# EasyEDA Pro project ProPrj_NavBot-EN01_2025-11-07.epro, schematic MAIN

## Sheets
1 P1: Board Name: MAIN; Create Date: 2025-05-14; Page Name: P1; Project Name: NavBot-EN01; Schematic Name: MAIN; Update Date: 2025-10-31; Add into BOM: yes; Convert to PCB: yes; Date: 2022-08-08; Draw By: MUSHIBO; REV: 1.0; Sheet: 1/1
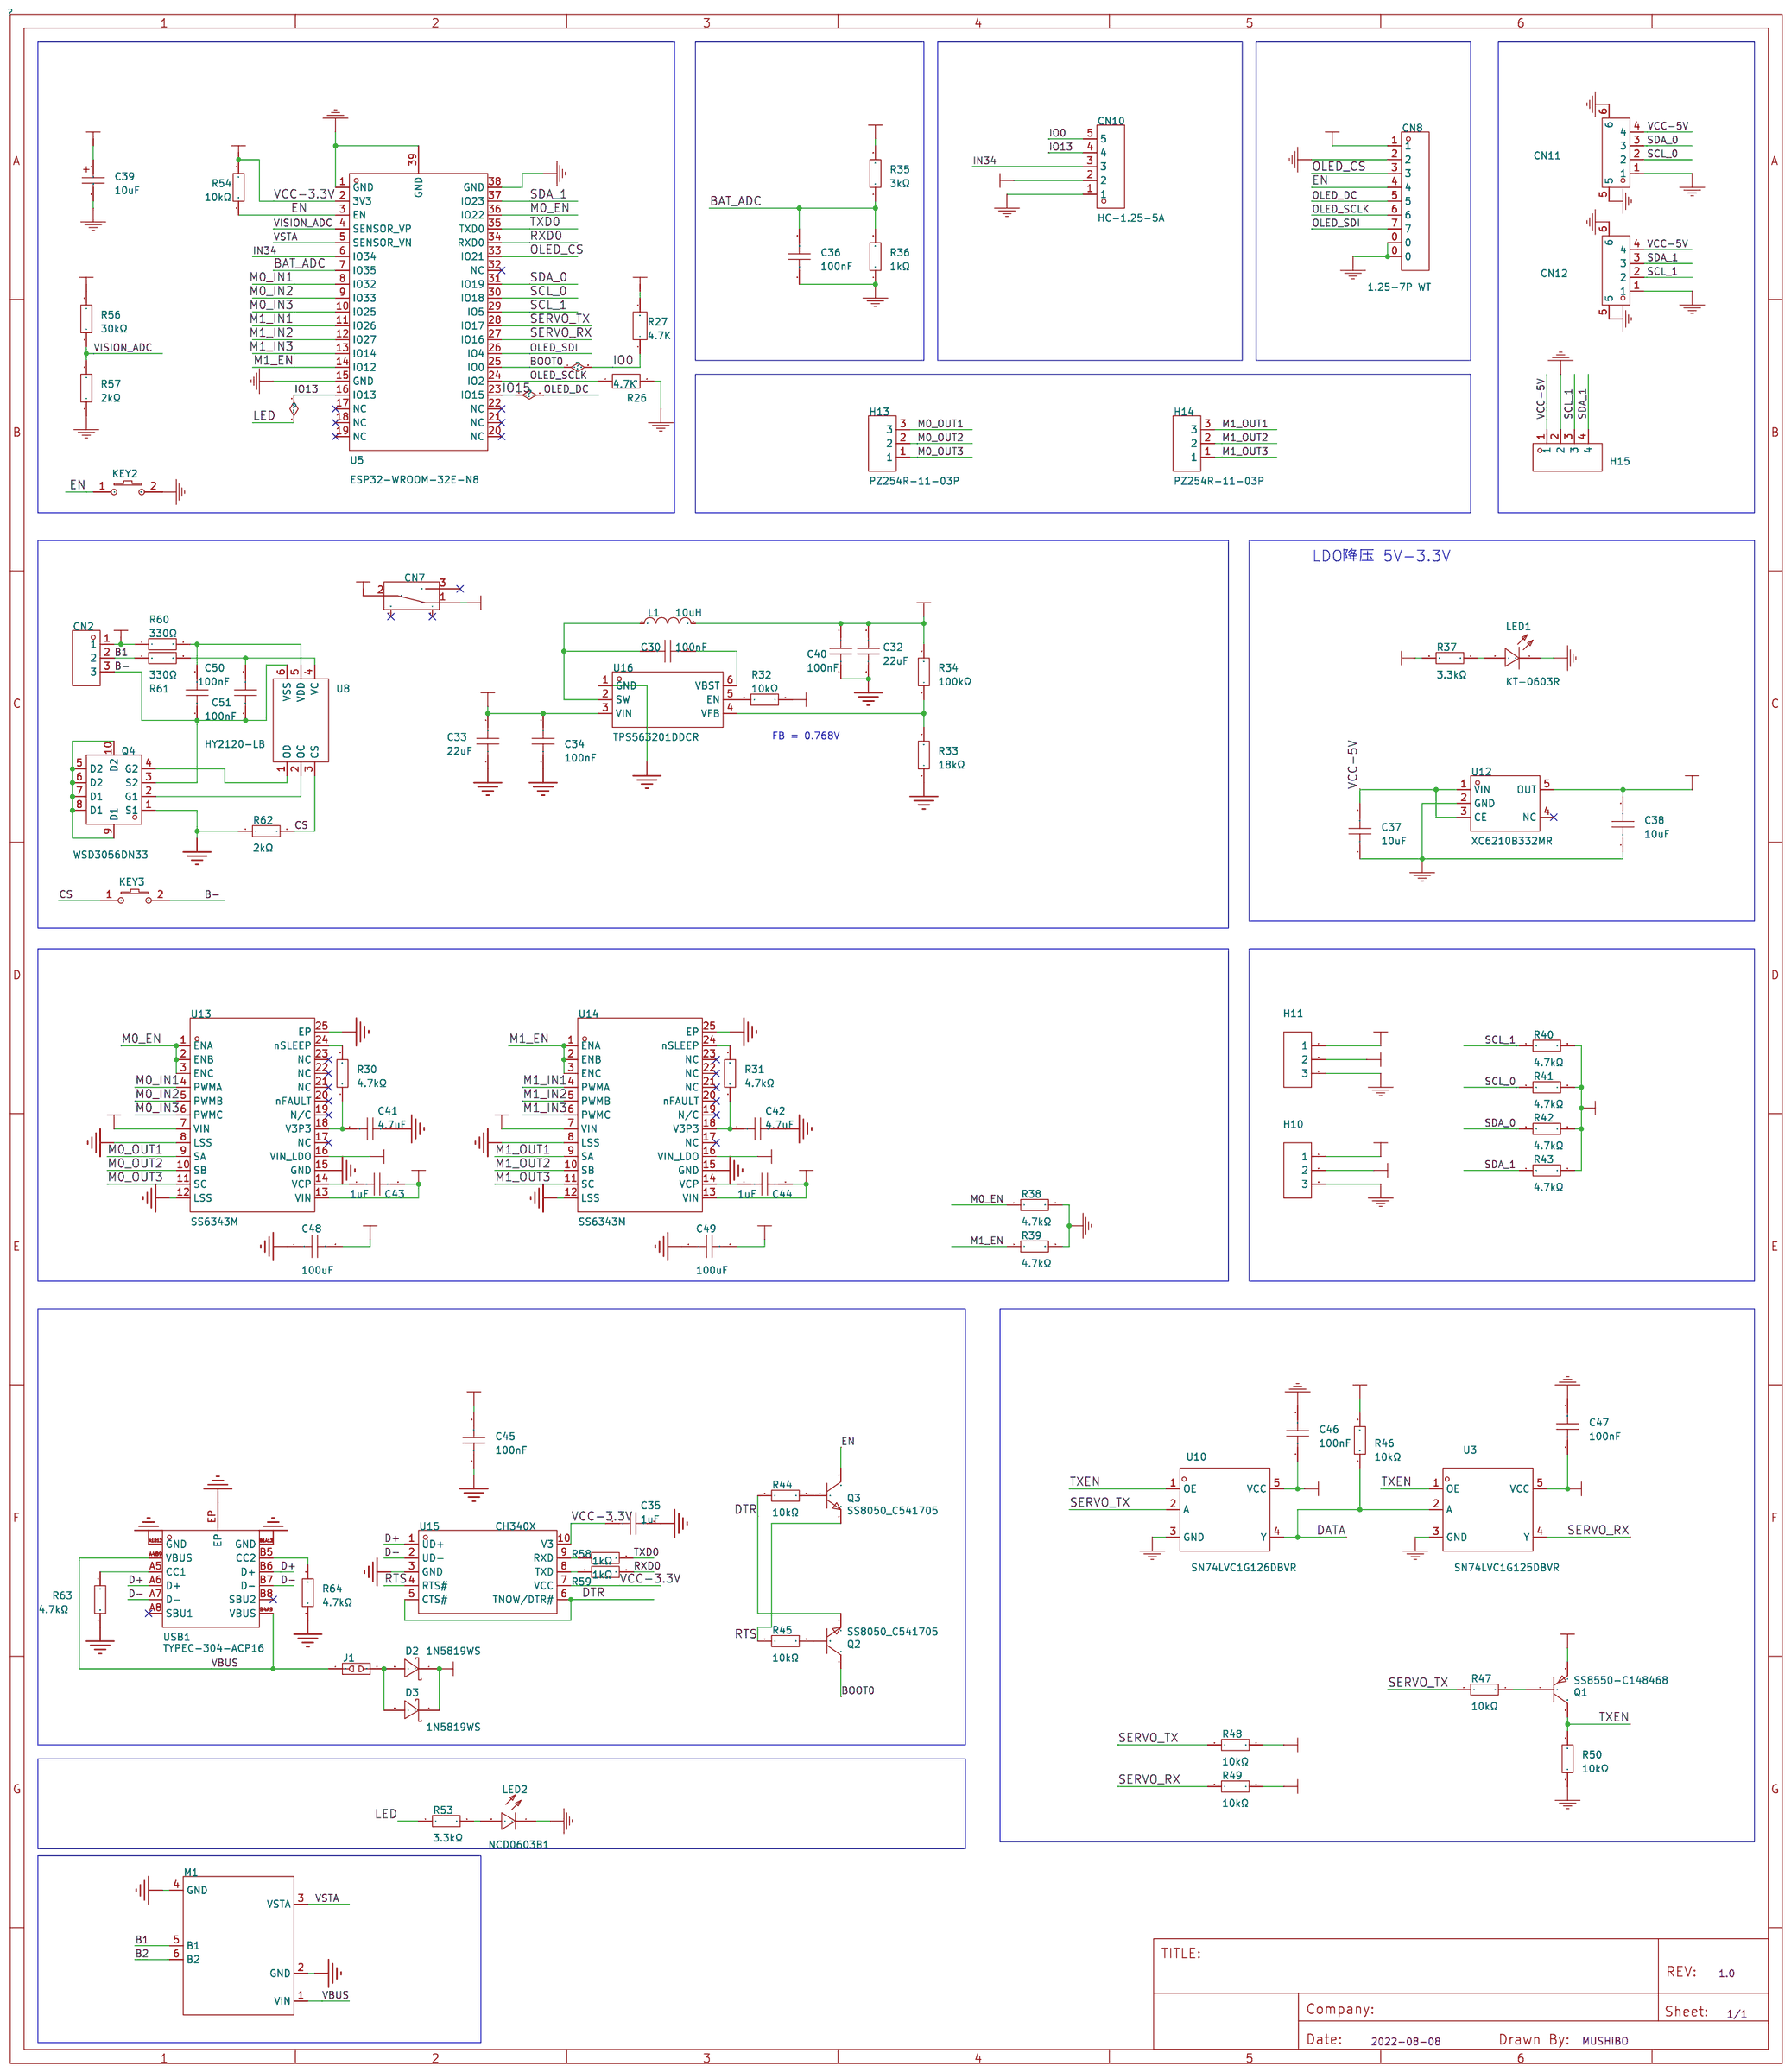
[diagram p6: P1]
2 version: Create Date: 2025-07-21; Page Name: version; Update Date: 2025-09-17; Company: 嘉立创EDA; Page Size: A4; Version: V1.0
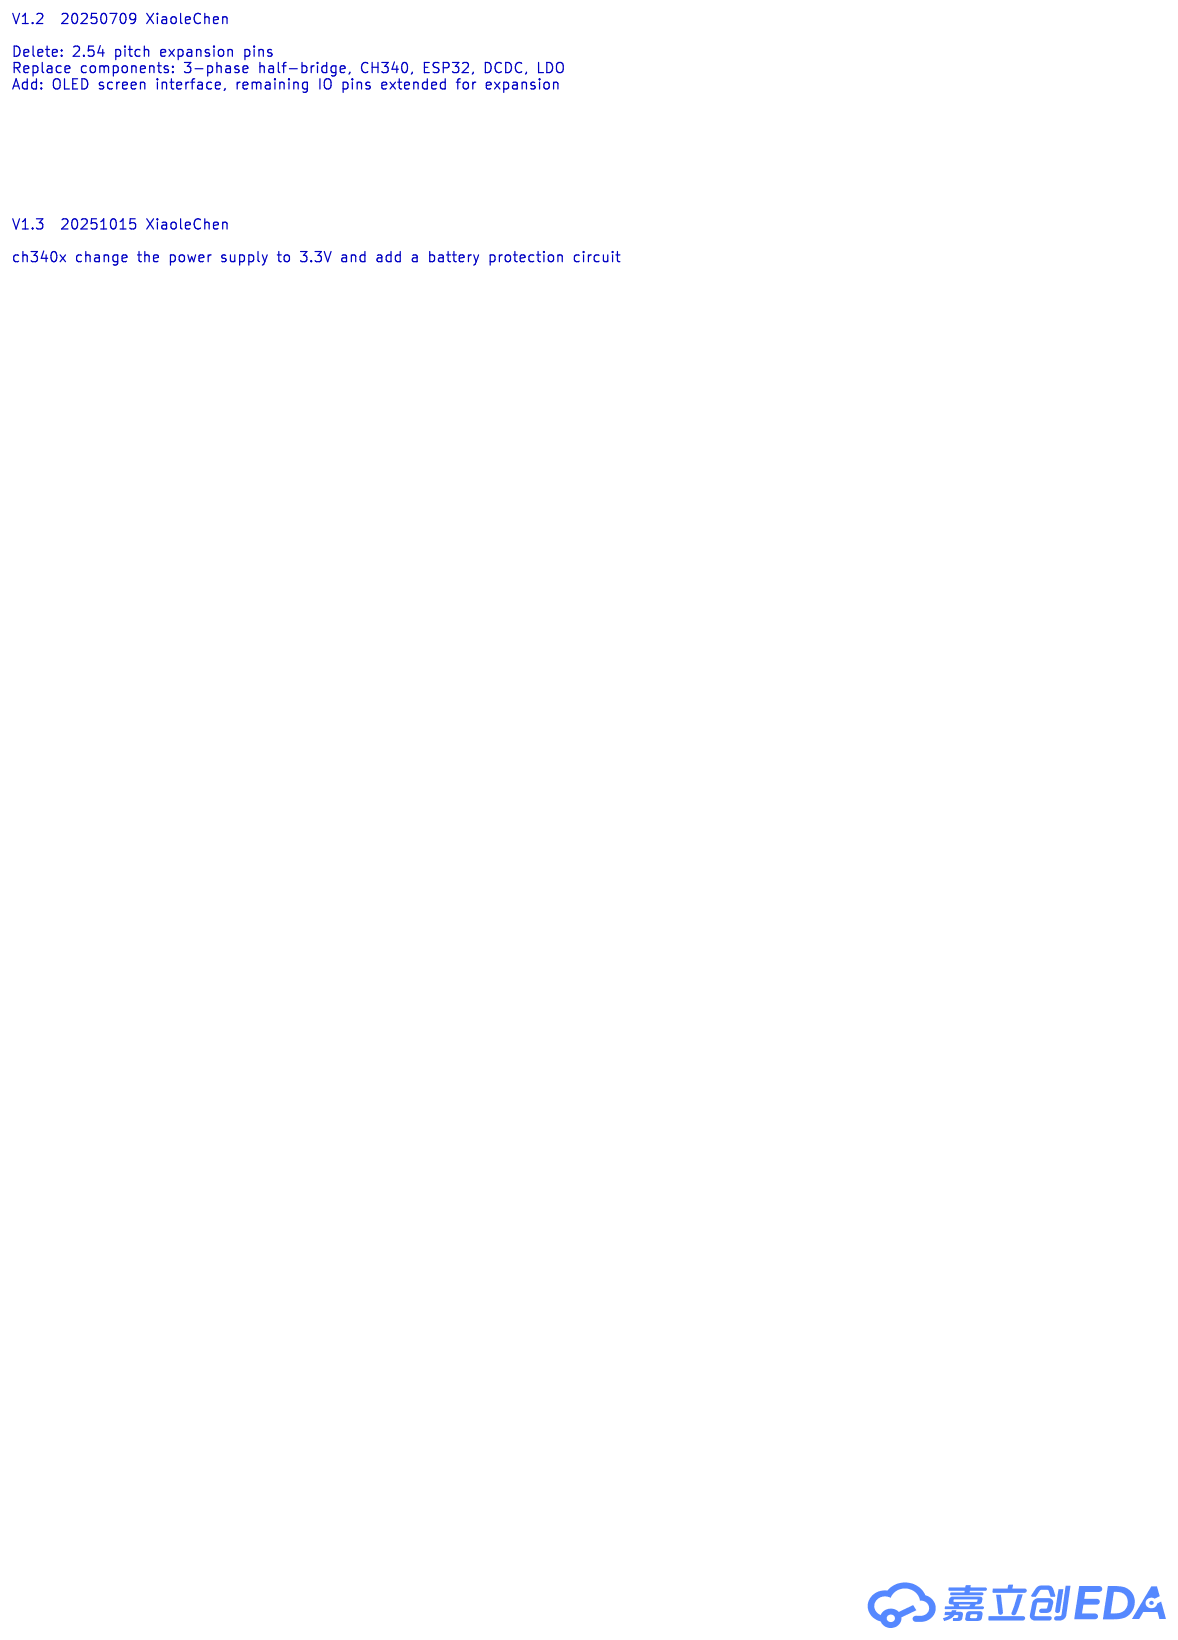
[diagram p7: version]

## Parts
C30  100nF  [C0603]
C32  22uF  [C0805]
C33  22uF  [C0805]
C34  100nF  [C0603]
C35  1uF  [C0603]
C36  100nF  [C0603]
C37  10uF  [C0603]
C38  10uF  [C0603]
C39  10uF  [CAP-SMD_L3.2-W1.6-RD-C7171]
C40  100nF  [C0603]
C41  4.7uF  [C0603]
C42  4.7uF  [C0603]
C43  1uF  [C0603]
C44  1uF  [C0603]
C45  100nF  [C0603]
C46  100nF  [C0603]
C47  100nF  [C0603]
C48  100uF  [C1206]
C49  100uF  [C1206]
C50  100nF  [C0603]
C51  100nF  [C0603]
CN2  HX25003-3WAP  [CONN-TH_3P-P2.50_HX25003-3WAP]
CN7  SS-12D02-VG4  [SW-TH_SS-12D02-VG4]
CN8  1.25-7P WT  [CONN-SMD_7P-P1.25-L4.4-W13.5]
CN10  HC-1.25-5A  [CONN-TH_5P-P1.25_HCTL_HC-1.25-5A]
CN11  WAFER-SH1.0-4PWB  [CONN-SMD_4P-P1.00_WAFER-SH1.0-4PWB]
CN12  WAFER-SH1.0-4PWB  [CONN-SMD_4P-P1.00_WAFER-SH1.0-4PWB]
D2  1N5819WS  [SOD-323_L1.8-W1.3-LS2.5-RD]
D3  1N5819WS  [SOD-323_L1.8-W1.3-LS2.5-RD]
H10  5264-3A  [CONN-TH_5264-3AW]
H11  5264-3A  [CONN-TH_5264-3AW]
H13  PZ254R-11-03P  [HDR-TH_3P-P2.54-H-M-W10.4]
H14  PZ254R-11-03P  [HDR-TH_3P-P2.54-H-M-W10.4]
H15  -  [HDR-TH_4P-P2.54-V-M]
J1  -  [0805短接点_FG]  (no BOM)
KEY2  K2-3.6×6.1_SMD  [KEY-SMD_2P-L6.2-W3.6-LS8.0]
KEY3  K2-3.6×6.1_SMD  [KEY-SMD_2P-L6.2-W3.6-LS8.0]
L1  10uH  [IND-SMD_L7.3-W6.6]
LED1  KT-0603R  [LED0603-RD]
LED2  NCD0603B1  [LED0603-RD]
M1  -  [2S充电模块]
Q1  SS8550-C148468  [SOT-23-3_L2.9-W1.3-P1.90-LS2.4-BR]
Q2  SS8050_C541705  [SOT-23-3_L2.9-W1.3-P1.90-LS2.4-BR]
Q3  SS8050_C541705  [SOT-23-3_L2.9-W1.3-P1.90-LS2.4-BR]
Q4  WSD3056DN33  [POWERPAK-SO-8_L3.0-W3.0-P0.65-BL]
R26  4.7K  [R0603]
R27  4.7K  [R0603]
R30  4.7kΩ  [R0603]
R31  4.7kΩ  [R0603]
R32  10kΩ  [R0603]
R33  18kΩ  [R0603]
R34  100kΩ  [R0603]
R35  3kΩ  [R0603]
R36  1kΩ  [R0603]
R37  3.3kΩ  [R0603]
R38  4.7kΩ  [R0603]
R39  4.7kΩ  [R0603]
R40  4.7kΩ  [R0603]
R41  4.7kΩ  [R0603]
R42  4.7kΩ  [R0603]
R43  4.7kΩ  [R0603]
R44  10kΩ  [R0603]
R45  10kΩ  [R0603]
R46  10kΩ  [R0603]
R47  10kΩ  [R0603]
R48  10kΩ  [R0603]
R49  10kΩ  [R0603]
R50  10kΩ  [R0603]
R53  3.3kΩ  [R0603]
R54  10kΩ  [R0603]
R56  30kΩ  [R0603]
R57  2kΩ  [R0603]
R58  1kΩ  [R0603]
R59  1kΩ  [R0603]
R60  330Ω  [R0603]
R61  330Ω  [R0603]
R62  2kΩ  [R0603]
R63  4.7kΩ  [R0603]
R64  4.7kΩ  [R0603]
U3  SN74LVC1G125DBVR  [SOT-23-5_L3.0-W1.7-P0.95-LS2.8-BR]
U5  ESP32-WROOM-32E-N8  [WIFI-SMD_ESP32-WROOM-32E]
U8  HY2120-LB  [SOT-23-6_L2.9-W1.6-P0.95-LS2.8-BR]
U10  SN74LVC1G126DBVR  [SOT-23-5_L3.0-W1.7-P0.95-LS2.8-BR]
U12  XC6210B332MR  [SOT-23-5_L2.9-W1.6-P0.95-LS2.8-BR]
U13  SS6343M  [QFN-24_L4.0-W3.0-P0.40-TL-EP]
U14  SS6343M  [QFN-24_L4.0-W3.0-P0.40-TL-EP]
U15  CH340X  [MSOP-10_L3.0-W3.0-P0.50-LS5.0-BL]
U16  TPS563201DDCR  [SOT-23-6_L2.9-W1.6-P0.95-LS2.8-BR]
USB1  TYPEC-304-ACP16  [USB-C-SMD_TYPE-C-16P-1]

## Library data of the parts
C30 C34 C36 C40 C45-C47 = CC0603KRX7R9BB104: 容值:100nF;精度:±10%;额定电压:50V;材质(温度系数):X7R;; LCSC Part Name: 100nF ±10% 50V; Supplier Part: C14663; Manufacturer: YAGEO(国巨); Supplier Footprint: 0603; JLCPCB Part Class: 基础库; Datasheet: https://atta.szlcsc.com/upload/public/pdf/source/20180910/C282072_33301C7F631E79921B82A8DAC6BCC5B3.pdf; Supplier: LCSC; Tolerance: ±10%; Voltage Rated: 50V; Temperature Coefficient: X7R
C32 C33 = CL21A226MAQNNNE: 容值:22uF;精度:±20%;额定电压:25V;材质(温度系数):X5R;; LCSC Part Name: 22uF ±20% 25V; Supplier Part: C45783; Manufacturer: SAMSUNG(三星); Supplier Footprint: 0805; JLCPCB Part Class: 基础库; Datasheet: https://atta.szlcsc.com/upload/public/pdf/source/20160218/1457707763339.pdf; Supplier: LCSC; Tolerance: ±20%; Voltage Rated: 25V; Temperature Coefficient: X5R
C35 C43 C44 = CL10A105KB8NNNC: 容值:1uF;精度:±10%;额定电压:50V;材质(温度系数):X5R;; LCSC Part Name: 1uF ±10% 50V; Supplier Part: C15849; Manufacturer: SAMSUNG(三星); Supplier Footprint: 0603; JLCPCB Part Class: 基础库; Datasheet: https://atta.szlcsc.com/upload/public/pdf/source/20160218/1457707763339.pdf; Supplier: LCSC; Tolerance: ±10%; Voltage Rated: 50V; Temperature Coefficient: X5R
C37 C38 = CL10A106KP8NNNC: 容值:10uF;精度:±10%;额定电压:10V;材质(温度系数):X5R;; LCSC Part Name: 10uF ±10% 10V; Supplier Part: C19702; Manufacturer: SAMSUNG(三星); Supplier Footprint: 0603; JLCPCB Part Class: 基础库; Datasheet: https://atta.szlcsc.com/upload/public/pdf/source/20160218/1457707763339.pdf; Supplier: LCSC; Tolerance: ±10%; Voltage Rated: 10V; Temperature Coefficient: X5R
C39 = TAJA106K016RNJ: 容值:10uF;精度:±10%;额定电压:16V;等效串联电阻(ESR):3Ω@100kHz;; LCSC Part Name: 10uF ±10% 16V; Supplier Part: C7171; Manufacturer: Kyocera AVX; Supplier Footprint: CASE-A-3216-18(mm); JLCPCB Part Class: 基础库; Supplier: LCSC; Tolerance: ±10%; Voltage Rating: 16V; Equivalent Series Resistance(ESR): 3Ω@100kHz; Operating Temperature: -55℃~+125℃
C41 C42 = CL10A475KO8NNNC: 容值:4.7uF;精度:±10%;额定电压:16V;材质(温度系数):X5R;; LCSC Part Name: 4.7uF ±10% 16V; Supplier Part: C19666; Manufacturer: SAMSUNG(三星); Supplier Footprint: 0603; JLCPCB Part Class: 基础库; Datasheet: https://atta.szlcsc.com/upload/public/pdf/source/20160218/1457707763339.pdf; Supplier: LCSC; Tolerance: ±10%; Voltage Rated: 16V; Temperature Coefficient: X5R
C48 C49 = HGC1206R5107M100NSPJ: 容值:100uF;精度:±20%;额定电压:10V;温度系数:X5R;; LCSC Part Name: 100uF ±20% 10V; Supplier Part: C7432784; Manufacturer: Chinocera(华瓷); Supplier Footprint: 1206; JLCPCB Part Class: 扩展库; Datasheet: https://atta.szlcsc.com/upload/public/pdf/source/20240320/FAC3FEC40A78BC5CCCE96C232A94D860.pdf; Supplier: LCSC; Tolerance: ±20%; Voltage Rating: 10V; Temperature Coefficient: X5R
C50 C51 = CC0603KRX7R9BB104: 容值:100nF;精度:±10%;额定电压:50V;材质(温度系数):X7R;; LCSC Part Name: 100nF ±10% 50V; Supplier Part: C14663; Manufacturer: YAGEO(国巨); Supplier Footprint: 0603; JLCPCB Part Class: 基础库; Datasheet: https://atta.szlcsc.com/upload/public/pdf/source/20180910/C282072_33301C7F631E79921B82A8DAC6BCC5B3.pdf; Supplier: LCSC; Tolerance: ±10%; Voltage Rated: 50V; Temperature Coefficient: X7R; Voltage Rating: 50V
CN2 = HX25003-3WAP: Supplier: LCSC; Supplier Part: C442327; Manufacturer: HX(红星); JLCPCB Part Class: Extended Part
CN7 = SS-12D02-VG4: Supplier: LCSC; Supplier Part: C136719; Manufacturer: Rectangular Connectors - Contacts
CN8 = 1.25-7P WT: 插针结构:1x7P;间距:1.25mm;安装方式:卧贴;参考系列:PicoBlade(MX 1.25);总PIN数:7P;排数:1;每排PIN数:7;行距:-;额定电流:1A;触头材质:黄铜;触头镀层:锡;工作温度范围:-25℃~+85℃;; LCSC Part Name: 1x7P 间距:1.25mm 卧贴 系列:PicoBlade(MX 1.25); Supplier Part: C2681528; Manufacturer: SHOU HAN(首韩); Supplier Footprint: SMD,P=1.25mm,卧贴; JLCPCB Part Class: 扩展库; Datasheet: https://atta.szlcsc.com/upload/public/pdf/source/20210107/C2681529_22D70B53821B9BA4D70344DBAB526F9C.pdf; Supplier: LCSC; Pins Structure: 1x7P; Pitch: 1.25mm; Mounting Type: 卧贴; Reference Series: PicoBlade(MX 1.25); Number of Pins: 7P; Number of Rows: 1; Number of PINs Per Row: 7; Current Rating: 1A; Contact Material: 黄铜; Contact Plating: 锡; Operating Temperature: -25℃~+85℃; Voltage Rating: 125V; Plastic Material: LCP; Flame Retardant Rating: UL94V-0; Color: 米色
CN10 = HC-1.25-5A: 插针结构:1x5P;间距:1.25mm;安装方式:直插;参考系列:PicoBlade(MX 1.25);总PIN数:5P;排数:1;每排PIN数:5;行距:-;额定电流:1A;触头材质:黄铜;触头镀层:锡;工作温度范围:-25℃~+85℃;; LCSC Part Name: 1x5P 间距:1.25mm 直插 系列:PicoBlade(MX 1.25); Supplier Part: C2845523; Manufacturer: HCTL(华灿天禄); Supplier Footprint: 插件,P=1.25mm; JLCPCB Part Class: 扩展库; Datasheet: https://atta.szlcsc.com/upload/public/pdf/source/20230707/9C9BC153C15CECDA5FD17EC6041C1792.pdf; Supplier: LCSC; Pins Structure: 1x5P; Pitch: 1.25mm; Mounting Style: 直插; Reference Series: PicoBlade(MX 1.25); Number of Pins: 5P; Number of Rows: 1; Number of PINs Per Row: 5; Current Rating (Max): 1A; Contact Material: 黄铜; Contact Plating: 锡; Operating Temperature Range: -25℃~+85℃; Rated Voltage (Max): 125V; Plastic Material: PA46; Flame Retardant Rating: UL94V-0; Z-Height of the Board: 4.7mm; X-Length of Bottom Edge on Board (Spacing Line): 8mm; Y-Width of Bottom Edge on Board: 3.2mm
CN11 CN12 = WAFER-SH1.0-4PWB: 插针结构:1x4P;间距:1mm;安装方式:卧贴;参考系列:SH;总PIN数:4P;排数:1;每排PIN数:4;行距:-;额定电流:1A;触头材质:黄铜;触头镀层:-;工作温度:-25℃~+85℃;; LCSC Part Name: 1x4P 间距:1mm 卧贴 系列:SH; Supplier Part: C3029343; Manufacturer: XUNPU(讯普); Supplier Footprint: SMD,P=1mm,卧贴; JLCPCB Part Class: 扩展库; Datasheet: https://atta.szlcsc.com/upload/public/pdf/source/20220527/1879B8210BD3B2006BCEAC1A40D397B6.pdf; Supplier: LCSC; Pins Structure: 1x4P; Pitch: 1mm; Mounting Type: 卧贴; Reference Series: SH; Number of Pins: 4P; Number of Rows: 1; Number of PINs Per Row: 4; Current Rating: 1A; Contact Material: 黄铜; Operating Temperature: -25℃~+85℃; Voltage Rating: 50V; Plastic Material: LCP; Supplementary Features: 辅助焊脚; Color: 米色; Z-Height of the Board: 3.15mm; X-Length of Bottom Edge on Board (Spacing Line): 6.35mm; Y-Width of Bottom Edge on Board: 5.05mm
D2 D3 = 1N5819WS_C191023: 正向压降(Vf):600mV@1A;直流反向耐压(Vr):40V;整流电流:1A;; LCSC Part Name: 电压:40V 电流:1A; Supplier Part: C191023; Manufacturer: Hottech(合科泰); Supplier Footprint: SOD-323; JLCPCB Part Class: 基础库; Datasheet: https://atta.szlcsc.com/upload/public/pdf/source/20220428/3CB86FD8D28D653594B4E35F9D5AEFD9.pdf; Supplier: LCSC; Forward Voltage (Vf@If): 600mV@1A; Reverse Voltage (Vr): 40V; Rectified Current: 1A
H10 H11 = 5264-3A: Supplier Part: C146690; Supplier: LCSC
H13 H14 = PZ254R-11-03P: 插针结构:1x3P;间距:2.54mm;行距:-;圆针/方针:方针;安装方式:弯插;排数:单排;总PIN位数:3P;额定电流:-;额定电压:-;配合针长度:6mm;塑高:2.5mm;触头材质:黄铜;触头镀层:-;工作温度:-40℃~+105℃;颜色:黑色;; LCSC Part Name: 1x3P 间距:2.54mm 方针 弯插; Supplier Part: C492411; Manufacturer: XFCN(兴飞); Supplier Footprint: 弯插,P=2.54mm; JLCPCB Part Class: 扩展库; Datasheet: https://atta.szlcsc.com/upload/public/pdf/source/20200309/C492411_5256E8AAA7569F6D33B6ADBFAE4F2888.pdf; Supplier: LCSC; Pin Structure: 1x3P; Pitch: 2.54mm; Circluar Pins/Square Pins: 方针; Mounting Type: 弯插; Number of Rows: 单排; Number of Pins: 3P; Length of Mating Pin: 6mm; Insulation Height: 2.5mm; Contact Material: 黄铜; Operating Temperature: -40℃~+105℃; Color: 黑色
H15 = HDR-M_2.54_1x4P: Supplier Part: C492403; Supplier Footprint: 插件
J1 = 0805短接点: Supplier Footprint: 0805; JLCPCB Part Class: Basic Part
KEY2 KEY3 = K2-1107ST-A4SW-06: Supplier Part: C118141; Supplier: LCSC; 制造商: 韩国韩荣
L1 = SMMS0630-100M: 电感值:10uH;精度:±20%;额定电流:-;饱和电流(Isat):5.5A;类型:一体成型电感;; LCSC Part Name: 10uH ±20% 5.5A; Supplier Part: C128692; Manufacturer: SXN(顺翔诺); Supplier Footprint: SMD,6.6x7.3mm; JLCPCB Part Class: 扩展库; Datasheet: https://atta.szlcsc.com/upload/public/pdf/source/20210810/BBF24330FB2F5029F637830BA9C42C0D.pdf; Supplier: LCSC; Tolerance: ±20%; Saturation Current (Isat): 5.5A; DC Resistance (DCR): 68mΩ; Type: 一体成型电感
LED1 = KT-0603R: 发光颜色:红色;功率:-;正向电流:-;主波长:-;二极管配置:-;透镜颜色:-;色温:-;发光角度:-;载带方式:-;工作温度:-40℃~+85℃;; LCSC Part Name: 0603 红灯 高亮; Supplier Part: C2286; Manufacturer: KENTO; Supplier Footprint: 0603; JLCPCB Part Class: 基础库; Datasheet: https://atta.szlcsc.com/upload/public/pdf/source/20160616/1466072038404.pdf; Supplier: LCSC; Emitted Color: 红色; Operating Temperature: -40℃~+85℃
LED2 = NCD0603B1: 灯头类型:-;发光颜色:-;正向压降(Vf):2.6V~3.6V;功率:72mW;正向电流:10mA;波长:463nm~475nm;二极管配置:-;透镜颜色:-;色温:-;发光强度:80mcd~220mcd;发光角度:130°;载带方式:-;工作温度:-30℃~+85℃;; Supplier Part: C84266; Manufacturer: 国星光电; Supplier Footprint: 0603; JLCPCB Part Class: 扩展库; Datasheet: https://atta.szlcsc.com/upload/public/pdf/source/20200820/C84266_6A3CDBEFA72C6CAD68EDA53474ADAE6C.pdf; Supplier: LCSC; Voltage - Forward(Vf): 2.6V~3.6V; Power(Watts): 72mW; Forward Current: 10mA; Wavelength - Dominant: 463nm~475nm; Luminous Intensity: 80mcd~220mcd; Viewing Angle: 130°; Operating Temperature: -30℃~+85℃
M1 = 2S_RECHARGE
Q1 = SS8550: Supplier: LCSC; Manufacturer: Yenji; Supplier Part: C148468
Q2 Q3 = SS8050: Supplier: LCSC; Supplier Part: C541705; Manufacturer: AnBon
Q4 = WSD3056DN33: 数量:2个N沟道;漏源电压(Vdss):30V;连续漏极电流(Id):35A;导通电阻(RDS(on)):13mΩ@10V;耗散功率(Pd):27W;阈值电压(Vgs(th)):2.5V@250uA;; LCSC Part Name: 2个N沟道 耐压:30V 电流:35A; Supplier Part: C2758429; Manufacturer: WINSOK(微硕); Supplier Footprint: DFN-8(3x3); JLCPCB Part Class: 扩展库; Datasheet: https://item.szlcsc.com/datasheet/WSD3056DN33/2876928.html; Supplier: LCSC; Number: 2个N沟道; Drain to Source Voltage: 30V; Current - Continuous Drain(Id): 35A; RDS(on): 13mΩ@10V; Pd - Power Dissipation: 27W; Gate Threshold Voltage (Vgs(th)): 2.5V@250uA; Gate Charge(Qg): 7.2nC@10V; Input Capacitance(Ciss): 620pF; Reverse Transfer Capacitance (Crss@Vds): 30pF; Operating Temperature: -55℃~+150℃; Type: N沟道; Output Capacitance(Coss): 85pF
R26 R27 = 4.7K
R30 R31 R38-R43 R63 R64 = 0603WAF4701T5E: 电阻类型:厚膜电阻;阻值:4.7kΩ;精度:±1%;功率:100mW;最大工作电压:75V;温度系数:±100ppm/℃;; LCSC Part Name: 4.7kΩ ±1% 100mW 厚膜电阻; Supplier Part: C23162; Manufacturer: UNI-ROYAL(厚声); Supplier Footprint: 0603; JLCPCB Part Class: 基础库; Datasheet: https://atta.szlcsc.com/upload/public/pdf/source/20200306/C422600_1E6D84923E4A46A82E41ADD87F860B5C.pdf; Supplier: LCSC; Type: 厚膜电阻; Tolerance: ±1%; Power(Watts): 100mW; Overload Voltage (Max): 75V; Temperature Coefficient: ±100ppm/℃; Operating Temperature Range: -55℃~+155℃
R32 R44-R50 R54 = 0603WAF1002T5E: 电阻类型:厚膜电阻;阻值:10kΩ;精度:±1%;功率:100mW;最大工作电压:75V;温度系数:±100ppm/℃;; LCSC Part Name: 厚膜电阻 10kΩ ±1% 100mW; Supplier Part: C25804; Manufacturer: UNI-ROYAL(厚声); Supplier Footprint: 0603; JLCPCB Part Class: 基础库; Datasheet: https://atta.szlcsc.com/upload/public/pdf/source/20200306/C422600_1E6D84923E4A46A82E41ADD87F860B5C.pdf; Supplier: LCSC; Type: 厚膜电阻; Tolerance: ±1%; Power(Watts): 100mW; Overload Voltage (Max): 75V; Temperature Coefficient: ±100ppm/℃; Operating Temperature Range: -55℃~+155℃
R33 = 0603WAF1802T5E: 电阻类型:厚膜电阻;阻值:18kΩ;精度:±1%;功率:100mW;最大工作电压:75V;温度系数:±100ppm/℃;; LCSC Part Name: 18kΩ ±1% 100mW 厚膜电阻; Supplier Part: C25810; Manufacturer: UNI-ROYAL(厚声); Supplier Footprint: 0603; JLCPCB Part Class: 基础库; Datasheet: https://atta.szlcsc.com/upload/public/pdf/source/20200306/C422600_1E6D84923E4A46A82E41ADD87F860B5C.pdf; Supplier: LCSC; Type: 厚膜电阻; Tolerance: ±1%; Power(Watts): 100mW; Overload Voltage (Max): 75V; Temperature Coefficient: ±100ppm/℃; Operating Temperature Range: -55℃~+155℃
R34 = 0603WAF1003T5E: 电阻类型:厚膜电阻;阻值:100kΩ;精度:±1%;功率:100mW;最大工作电压:75V;温度系数:±100ppm/℃;; LCSC Part Name: 100kΩ ±1% 100mW 厚膜电阻; Supplier Part: C25803; Manufacturer: UNI-ROYAL(厚声); Supplier Footprint: 0603; JLCPCB Part Class: 基础库; Datasheet: https://atta.szlcsc.com/upload/public/pdf/source/20200306/C422600_1E6D84923E4A46A82E41ADD87F860B5C.pdf; Supplier: LCSC; Type: 厚膜电阻; Tolerance: ±1%; Power(Watts): 100mW; Overload Voltage (Max): 75V; Temperature Coefficient: ±100ppm/℃; Operating Temperature Range: -55℃~+155℃
R35 = 0603WAF3001T5E: 电阻类型:厚膜电阻;阻值:3kΩ;精度:±1%;功率:100mW;工作电压:75V;温度系数:±100ppm/℃;; LCSC Part Name: 3kΩ ±1% 100mW 厚膜电阻; Supplier Part: C4211; Manufacturer: UNI-ROYAL(厚声); Supplier Footprint: 0603; JLCPCB Part Class: 基础库; Datasheet: https://atta.szlcsc.com/upload/public/pdf/source/20200306/C422600_1E6D84923E4A46A82E41ADD87F860B5C.pdf; Supplier: LCSC; Type: 厚膜电阻; Tolerance: ±1%; Power(Watts): 100mW; Voltage-Supply(Max): 75V; Temperature Coefficient: ±100ppm/℃; Operating Temperature: -55℃~+155℃
R36 R58 R59 = 0603WAF1001T5E: 电阻类型:厚膜电阻;阻值:1kΩ;精度:±1%;功率:100mW;最大工作电压:75V;温度系数:±100ppm/℃;; LCSC Part Name: 1kΩ ±1% 100mW 厚膜电阻; Supplier Part: C21190; Manufacturer: UNI-ROYAL(厚声); Supplier Footprint: 0603; JLCPCB Part Class: 基础库; Datasheet: https://atta.szlcsc.com/upload/public/pdf/source/20200306/C422600_1E6D84923E4A46A82E41ADD87F860B5C.pdf; Supplier: LCSC; Type: 厚膜电阻; Tolerance: ±1%; Power(Watts): 100mW; Overload Voltage (Max): 75V; Temperature Coefficient: ±100ppm/℃; Operating Temperature Range: -55℃~+155℃
R37 R53 = 0603WAF3301T5E: 电阻类型:厚膜电阻;阻值:3.3kΩ;精度:±1%;功率:100mW;最大工作电压:75V;温度系数:±100ppm/℃;; LCSC Part Name: 3.3kΩ ±1% 100mW 厚膜电阻; Supplier Part: C22978; Manufacturer: UNI-ROYAL(厚声); Supplier Footprint: 0603; JLCPCB Part Class: 基础库; Datasheet: https://atta.szlcsc.com/upload/public/pdf/source/20200306/C422600_1E6D84923E4A46A82E41ADD87F860B5C.pdf; Supplier: LCSC; Type: 厚膜电阻; Tolerance: ±1%; Power(Watts): 100mW; Overload Voltage (Max): 75V; Temperature Coefficient: ±100ppm/℃; Operating Temperature Range: -55℃~+155℃
R56 = 0603WAF3002T5E: 电阻类型:厚膜电阻;阻值:30kΩ;精度:±1%;功率:100mW;最大工作电压:75V;温度系数:±100ppm/℃;; LCSC Part Name: 30kΩ ±1% 100mW 厚膜电阻; Supplier Part: C22984; Manufacturer: UNI-ROYAL(厚声); Supplier Footprint: 0603; JLCPCB Part Class: 基础库; Datasheet: https://atta.szlcsc.com/upload/public/pdf/source/20200306/C422600_1E6D84923E4A46A82E41ADD87F860B5C.pdf; Supplier: LCSC; Type: 厚膜电阻; Tolerance: ±1%; Power(Watts): 100mW; Overload Voltage (Max): 75V; Temperature Coefficient: ±100ppm/℃; Operating Temperature Range: -55℃~+155℃
R57 = 0603WAF2001T5E: 电阻类型:厚膜电阻;阻值:2kΩ;精度:±1%;功率:100mW;最大工作电压:75V;温度系数:±100ppm/℃;; LCSC Part Name: 2kΩ ±1% 100mW 厚膜电阻; Supplier Part: C22975; Manufacturer: UNI-ROYAL(厚声); Supplier Footprint: 0603; JLCPCB Part Class: 基础库; Datasheet: https://atta.szlcsc.com/upload/public/pdf/source/20200306/C422600_1E6D84923E4A46A82E41ADD87F860B5C.pdf; Supplier: LCSC; Type: 厚膜电阻; Tolerance: ±1%; Power(Watts): 100mW; Overload Voltage (Max): 75V; Temperature Coefficient: ±100ppm/℃; Operating Temperature Range: -55℃~+155℃
R60 R61 = 0603WAF3300T5E: 电阻类型:厚膜电阻;阻值:330Ω;精度:±1%;功率:100mW;最大工作电压:75V;温度系数:±100ppm/℃;; LCSC Part Name: 330Ω ±1% 100mW 厚膜电阻; Supplier Part: C23138; Manufacturer: UNI-ROYAL(厚声); Supplier Footprint: 0603; JLCPCB Part Class: 基础库; Datasheet: https://atta.szlcsc.com/upload/public/pdf/source/20200306/C422600_1E6D84923E4A46A82E41ADD87F860B5C.pdf; Supplier: LCSC; Type: 厚膜电阻; Tolerance: ±1%; Power(Watts): 100mW; Overload Voltage (Max): 75V; Temperature Coefficient: ±100ppm/℃; Operating Temperature Range: -55℃~+155℃
R62 = 0603WAF2001T5E: 电阻类型:厚膜电阻;阻值:2kΩ;精度:±1%;功率:100mW;最大工作电压:75V;温度系数:±100ppm/℃;; LCSC Part Name: 2kΩ ±1% 100mW 厚膜电阻; Supplier Part: C22975; Manufacturer: UNI-ROYAL(厚声); Supplier Footprint: 0603; JLCPCB Part Class: 基础库; Datasheet: https://atta.szlcsc.com/upload/public/pdf/source/20200306/C422600_1E6D84923E4A46A82E41ADD87F860B5C.pdf; Supplier: LCSC; Type: 厚膜电阻; Tolerance: ±1%; Power(Watts): 100mW; Overload Voltage (Max): 75V; Temperature Coefficient: ±100ppm/℃; Operating Temperature Range: -55℃~+155℃; Voltage-Supply(Max): 75V; Operating Temperature: -55℃~+155℃
U3 = SN74LVC1G125DBVR: Supplier: LCSC; Manufacturer: TI; image: //image.lceda.cn/szlcsc/C23654.jpg; Supplier Part: C23654; JLCPCB Part Class: Extend
U5 = ESP32-WROOM-32E-N8: ESP32-WROOM-32E 集成 ESP32-D0WD-V3 芯片，具有?高的稳定性和安全性能。; LCSC Part Name: 通用型Wi-Fi+BT+BLE MCU模组; Supplier Part: C701342; Manufacturer: ESPRESSIF(乐鑫); Supplier Footprint: SMD,18x25.5mm; JLCPCB Part Class: 扩展库; Datasheet: https://atta.szlcsc.com/upload/public/pdf/source/20240307/DEBA00FAE5BA634F0D73085E4F214E93.pdf; Supplier: LCSC
U8 = HY2120-LB: 工作电压:1.5V~10V;电池类型:锂离子/聚合物;电池节数:2;; LCSC Part Name: 双节锂离子/锂聚合物电池组保护IC; Supplier Part: C168778; Manufacturer: HYCON(宏康); Supplier Footprint: SOT-23-6; JLCPCB Part Class: 扩展库; Datasheet: https://item.szlcsc.com/datasheet/HY2120-LB/180162.html; Supplier: LCSC; The Chip Type: 保护芯片; Voltage - Supply: 1.5V~10V; Charging Saturation Voltage: 4.25V; End-Off Voltage: 2.8V; Type of Battery: 锂离子/聚合物; Number of Cells: 2; Operating Temperature: -40℃~+85℃; 0V Battery Charge: 支持; Supply Current (Iq): 100nA
U10 = SN74LVC1G126DBVR: Supplier: LCSC; Manufacturer: TI; image: //image.lceda.cn/szlcsc/C23654.jpg; Supplier Part: C7834; JLCPCB Part Class: Extend
U12 = XC6210B332MR: LCSC Part Name: Higt PSRR Voltage Regulator; Supplier Part: C3021084; Manufacturer: TECH PUBLIC(台舟); Supplier Footprint: SOT-23-5; JLCPCB Part Class: 扩展库; Datasheet: https://atta.szlcsc.com/upload/public/pdf/source/20220524/E0126CADD4FAB104D4B88A5F9575F61A.pdf; Supplier: LCSC
U13 U14 = SS6343M: LCSC Part Name: 电机驱动芯片; Supplier Part: C5370899; Manufacturer: LEADPOWER(率能); Supplier Footprint: QFN3x4-24L; JLCPCB Part Class: 扩展库; Datasheet: https://atta.szlcsc.com/upload/public/pdf/source/20230606/81CA2751964E8985717632B32905C227.pdf; Supplier: LCSC
U15 = CH340X: Supplier Part: C3035748; Manufacturer: WCH(南京沁恒); Supplier Footprint: MSOP-10; JLCPCB Part Class: 扩展库; Datasheet: https://atta.szlcsc.com/upload/public/pdf/source/20230530/6E401E9554E9F5311886CC8B3F89B62E.pdf; Supplier: LCSC
U16 = TPS563201DDCR: 功能类型:降压型;输出类型:可调;工作电压:4.5V~17V;输出电压:768mV~7V;输出电流:3A;; LCSC Part Name: 4.5V至17V输入，3A同步降压电压调节器; Supplier Part: C116592; Manufacturer: TI(德州仪器); Supplier Footprint: SOT-23-THIN-6; JLCPCB Part Class: 扩展库; Datasheet: https://atta.szlcsc.com/upload/public/pdf/source/20230424/FEEFD13F14AFA838E4C009B2DDC1DFA0.pdf; Supplier: LCSC; Function: 降压型; Output Type: 可调; Voltage - Supply: 4.5V~17V; Output Voltage: 768mV~7V; Output Current: 3A; Frequency - Switching: 580kHz; Operating Temperature: -40℃~+125℃@(TJ); Synchronous Rectifier: 是; Number of Outputs: 1; Topology: 降压式; Switch tube (built-in/external): 内置
USB1 = TYPEC-304-ACP16: 连接器类型:Type-C;标准:-;公母:母;端口数量:1;触点数量:16P;安装方式:卧贴;额定电流 - 电源:3A;触头材质:铜;触头镀层:金;工作温度范围:-40℃~+85℃;焊接温度(最大值):-;; LCSC Part Name: Type-C 母 卧贴; Supplier Part: C2982555; Manufacturer: XUNPU(讯普); Supplier Footprint: SMD; JLCPCB Part Class: 扩展库; Datasheet: https://atta.szlcsc.com/upload/public/pdf/source/20220311/3C907F75E12F45E4EE7F73565AB9C294.pdf; Supplier: LCSC; Connector Type: Type-C; Gender: 母; Number of Ports: 1; Number of Contacts: 16P; Mounting Style: 卧贴; Current Rating - Power (Max): 3A; Contact Material: 铜; Contact Plating: 金; Operating Temperature Range: -40℃~+85℃

## Nets
GND: C32.1 C33.1 C34.1 C35.2 C36.1 C37.1 C38.1 C39.2 C40.1 C41.2 C42.2 C45.1 C46.2 C47.2 C48.1 C49.1 CN8.0 CN8.2 CN10.1 CN11.1 CN11.5 CN11.6 CN12.1 CN12.5 CN12.6 H10.3 H11.3 H15.2 KEY2.2 LED1.1(K) LED2.1(-) M1.2(GND) M1.4(GND) Q4.1(S1) R26.2 R33.1 R36.1 R38.2 R39.2 R50.1 R57.1 R62.1 R63.1 R64.1 U3.3(GND) U5.1(GND) U5.15(GND) U5.38(GND) U5.39(GND) U10.3(GND) U12.2(GND) U13.8(LSS) U13.12(LSS) U13.15(GND) U13.25(EP) U14.8(LSS) U14.12(LSS) U14.15(GND) U14.25(EP) U15.3(GND) U16.1(GND) USB1.A1B12(GND) USB1.B1A12(GND) USB1.EP
VBUS: J1.1 M1.1(VIN) USB1.A4B9(VBUS) USB1.B4A9(VBUS)
VCC-3.3V: C35.1 C38.2 C39.1 C45.2 C46.1 C47.1 Q1.2(E) R27.2 R37.1 R40.2 R41.2 R42.2 R43.2 R46.2 R48.2 R49.2 R54.1 R56.2 U3.5(VCC) U5.2(3V3) U10.5(VCC) U12.5(OUT) U15.7(VCC) U15.10(V3)
VCC-5V: C32.2 C37.2 C40.2 CN8.1 CN10.2 CN11.4 CN12.4 D2.1(K) D3.1(K) H15.1 L1.2 R34.2 U12.1(VIN) U12.3(CE)
VIN: C33.2 C34.2 C43.2 C44.2 C48.2 C49.2 CN7.1 H10.2 H11.2 R32.1 R35.2 U13.7(VIN) U13.13(VIN) U13.16(VIN_LDO) U14.7(VIN) U14.13(VIN) U14.16(VIN_LDO) U16.3(VIN)
B1: CN2.2 M1.5(B1) R61.1
B2: CN2.1 CN7.2 M1.6(B2) R60.1
B-: C50.1 C51.1 CN2.3 KEY3.2 Q4.3(S2) U8.6(VSS)
BAT_ADC: C36.2 R35.1 R36.2 U5.7(IO35)
BOOT0: CN10.5 Q2.3(C) R27.1 U5.25(IO0)
CS: KEY3.1 R62.2 U8.3(CS)
D+: U15.1(UD+) USB1.A6(D+) USB1.B6(D+)
D-: U15.2(UD-) USB1.A7(D-) USB1.B7(D-)
DATA: H10.1 H11.1 R46.1 U3.2(A) U10.4(Y)
DTR: Q2.2(E) R44.1 U15.5(CTS#) U15.6(TNOW/DTR#)
EN: CN8.4 KEY2.1 Q3.3(C) R54.2 U5.3(EN)
IN34: CN10.3 U5.6(IO34)
IO13: CN10.4 R53.1 U5.16(IO13)
IO15: CN8.5 U5.23(IO15)
M0_EN: R38.1 U5.36(IO22) U13.1(ENA) U13.2(ENB) U13.3(ENC)
M0_IN1: U5.8(IO32) U13.4(PWMA)
M0_IN2: U5.9(IO33) U13.5(PWMB)
M0_IN3: U5.10(IO25) U13.6(PWMC)
M0_OUT1: H13.3 U13.9(SA)
M0_OUT2: H13.2 U13.10(SB)
M0_OUT3: H13.1 U13.11(SC)
M1_EN: R39.1 U5.14(IO12) U14.1(ENA) U14.2(ENB) U14.3(ENC)
M1_IN1: U5.11(IO26) U14.4(PWMA)
M1_IN2: U5.12(IO27) U14.5(PWMB)
M1_IN3: U5.13(IO14) U14.6(PWMC)
M1_OUT1: H14.3 U14.9(SA)
M1_OUT2: H14.2 U14.10(SB)
M1_OUT3: H14.1 U14.11(SC)
OLED_CS: CN8.3 U5.33(IO21)
OLED_SCLK: CN8.6 R26.1 U5.24(IO2)
OLED_SDI: CN8.7 U5.26(IO4)
RTS: Q3.2(E) R45.1 U15.4(RTS#)
RXD0: R59.2 U5.34(RXD0)
SCL_0: CN11.2 R41.1 U5.30(IO18)
SCL_1: CN12.2 H15.3 R40.1 U5.29(IO5)
SDA_0: CN11.3 R42.1 U5.31(IO19)
SDA_1: CN12.3 H15.4 R43.1 U5.37(IO23)
SERVO_RX: R49.1 U3.4(Y) U5.27(IO16)
SERVO_TX: R47.1 R48.1 U5.28(IO17) U10.2(A)
TXD0: R58.2 U5.35(TXD0)
TXEN: Q1.3(C) R50.2 U3.1(OE) U10.1(OE)
VISION_ADC: R56.1 R57.2 U5.4(SENSOR_VP)
VSTA: M1.3(VSTA) U5.5(SENSOR_VN)
$1N6461: LED1.2(A) R37.2
$1N6486: Q1.1(B) R47.2
$1N6507: LED2.2(+) R53.2
$1N16875: C43.1 U13.14(VCP)
$1N17094: C41.1 R30.1 U13.18(V3P3)
$1N17219: R30.2 U13.24(nSLEEP)
$1N17548: C44.1 U14.14(VCP)
$1N17578: C42.1 R31.1 U14.18(V3P3)
$1N17586: R31.2 U14.24(nSLEEP)
$1N17803: R58.1 U15.9(RXD)
$1N17807: R59.1 U15.8(TXD)
$1N18226: C30.1 L1.1 U16.2(SW)
$1N18314: C30.2 U16.6(VBST)
$1N18404: R32.2 U16.5(EN)
$1N18959: R33.2 R34.1 U16.4(VFB)
$1N21795: Q3.1(B) R44.2
$1N21834: Q2.1(B) R45.2
$1N51806: D2.2(A) D3.2(A) J1.2
$1N52202: C50.2 R60.2 U8.5(VDD)
$1N52203: C51.2 R61.2 U8.4(VC)
$1N52206: Q4.5(D2) Q4.6(D2) Q4.7(D1) Q4.8(D1) Q4.9(D1) Q4.10(D2)
$1N55084: Q4.4(G2) U8.1(OD)
$1N55091: Q4.2(G1) U8.2(OC)
$1N62719: R63.2 USB1.A5(CC1)
$1N62774: R64.2 USB1.B5(CC2)

Not connected (* = marked no-connect by the designer): CN7 3* 4* 5*; U5 17(NC)* 18(NC)* 19(NC)* 20(NC)* 21(NC)* 22(NC)* 32(NC)*; U12 4(NC)*; U13 17(NC)* 19(N/C)* 20(nFAULT)* 21(NC)* 22(NC)* 23(NC)*; U14 17(NC)* 19(N/C)* 20(nFAULT)* 21(NC)* 22(NC)* 23(NC)*; USB1 A8(SBU1)* B8(SBU2)*

## Notes on the sheets
sheet 1
- LDO降压 5V-3.3V
- FB = 0.768V
sheet 2
- V1.2  20250709 XiaoleChen
  Delete: 2.54 pitch expansion pins
  Replace components: 3-phase half-bridge, CH340, ESP32, DCDC, LDO
  Add: OLED screen interface, remaining IO pins extended for expansion
- V1.3  20251015 XiaoleChen
  ch340x change the power supply to 3.3V and add a battery protection circuit
